# EasyEDA schematic PCBTASK_2021-05-22.json
TITLE: RPi shield to light 4 LEDs using buttons or pin input; REV: 1.0; Date: 2021-05-19; Sheet: 1/1; Drawn By: Mitchell Burcheri; Company: Deakin University
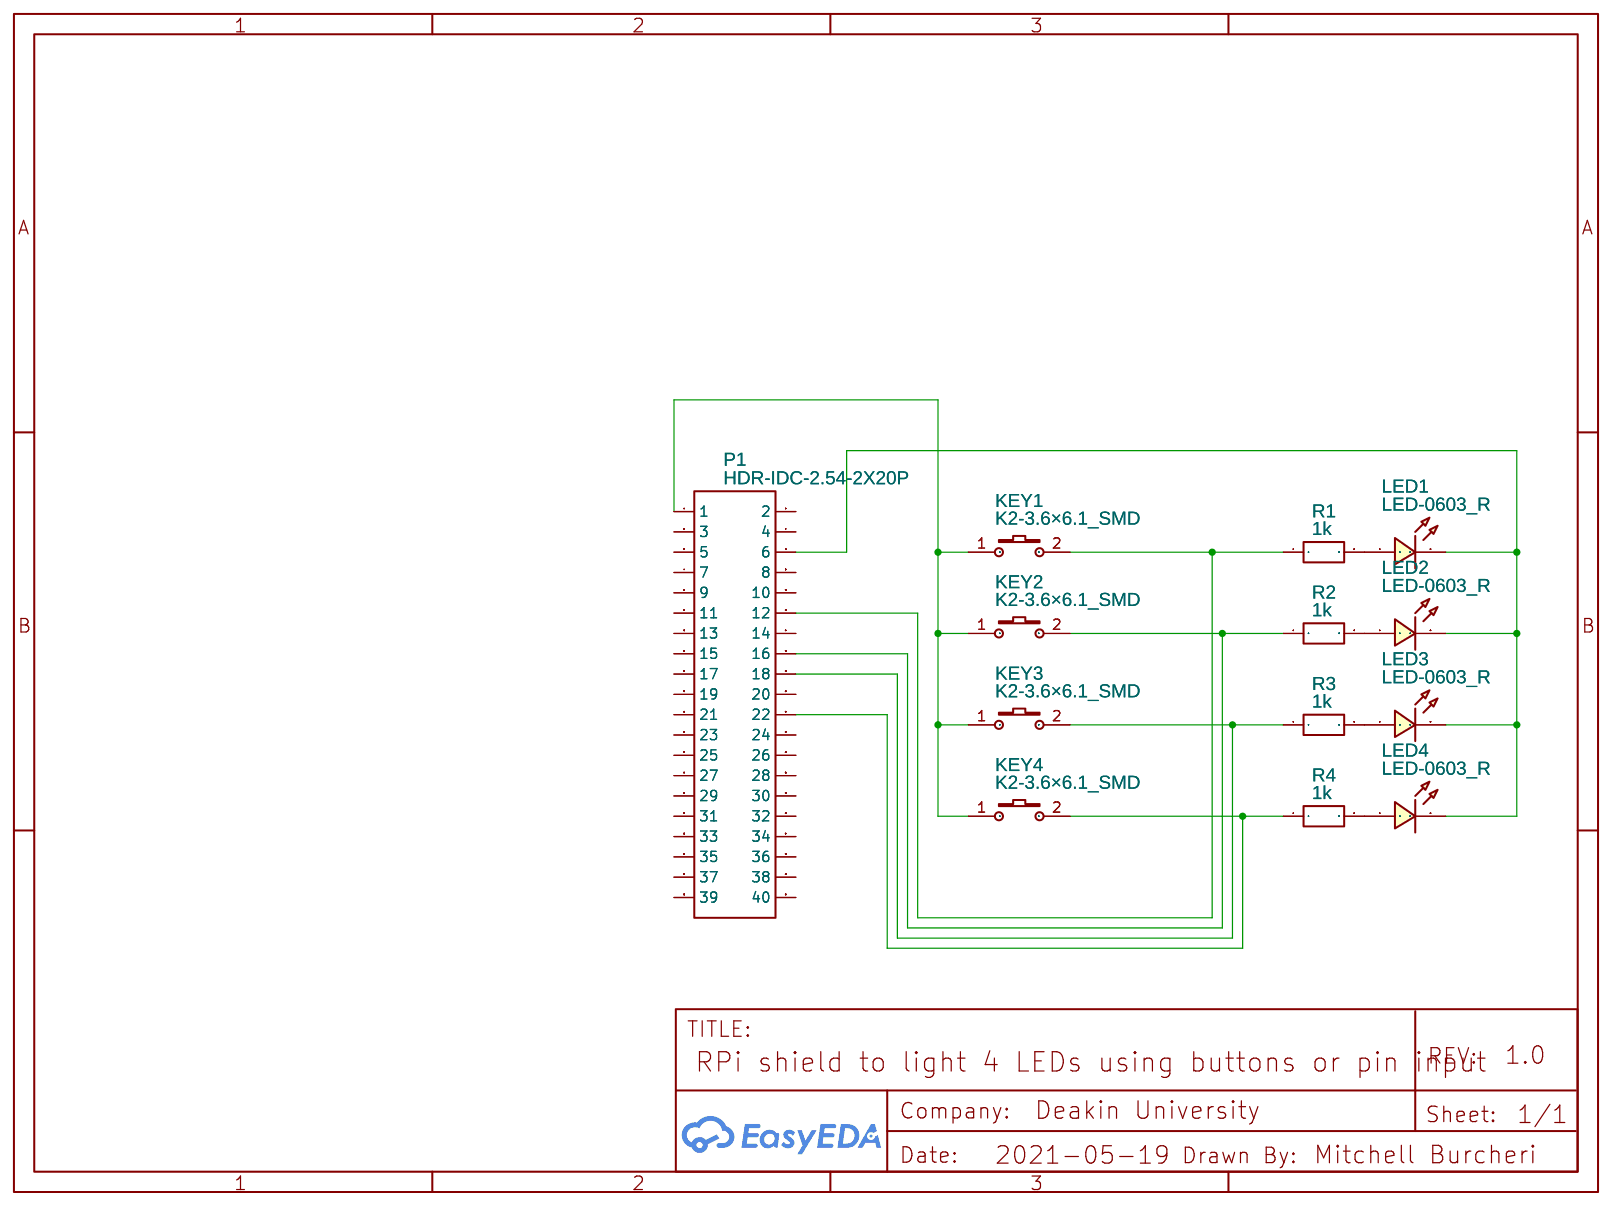
[diagram p0: schematic sheet]

## Parts
KEY1  K2-3.6×6.1_SMD  [KEY-SMD_2P-L6.2-W3.6-LS8.0]
KEY2  K2-3.6×6.1_SMD  [KEY-SMD_2P-L6.2-W3.6-LS8.0]
KEY3  K2-3.6×6.1_SMD  [KEY-SMD_2P-L6.2-W3.6-LS8.0]
KEY4  K2-3.6×6.1_SMD  [KEY-SMD_2P-L6.2-W3.6-LS8.0]
LED1  LED-0603_R  [LED0603_RED]
LED2  LED-0603_R  [LED0603_RED]
LED3  LED-0603_R  [LED0603_RED]
LED4  LED-0603_R  [LED0603_RED]
P1  HDR-IDC-2.54-2X20P  [IDC-TH_40P-P2.54_C9138]
R1  1k  [R0201]
R2  1k  [R0201]
R3  1k  [R0201]
R4  1k  [R0201]

## Library data of the parts
KEY1-KEY4 = K2-3.6×6.1_SMD: Supplier Part: C118141; Supplier: LCSC; Manufacturer Part: K2-1107ST-A4SW-06; Contributor: LCEDA_Lib; 制造商: 韩国韩荣
LED1-LED4 = LED-0603_R: Manufacturer: EVERLIGHT(台湾亿光); Manufacturer Part: 19-217/R6C-AL1M2VY/3T; Supplier Part: C72044; Supplier: LCSC; Contributor: LCEDA_01
P1 = HDR-IDC-2.54-2X20P: Supplier: LCSC; Manufacturer: BOOMELE; Manufacturer Part: IDC Box 2X20 2.54MM; image: //image.lceda.cn/szlcsc/C9138.jpg; Supplier Part: C9138
R1-R4 = R_0201_EU: Contributor: LCEDA_Lib

## Nets
Net-(KEY1-1): KEY1.1 KEY2.1 KEY3.1 KEY4.1 P1.1
Net-(KEY1-2): KEY1.2 P1.12 R1.1
Net-(KEY2-2): KEY2.2 P1.16 R2.1
Net-(KEY3-2): KEY3.2 P1.18 R3.1
Net-(KEY4-2): KEY4.2 P1.22 R4.1
Net-(LED1-1): LED1.1 R1.2
Net-(LED1-2): LED1.2 LED2.2 LED3.2 LED4.2 P1.6
Net-(LED2-1): LED2.1 R2.2
Net-(LED3-1): LED3.1 R3.2
Net-(LED4-1): LED4.1 R4.2

Not connected (* = marked no-connect by the designer): P1 2 3 4 5 7 8 9 10 11 13 14 15 17 19 20 21 23 24 25 26 27 28 29 30 31 32 33 34 35 36 37 38 39 40
